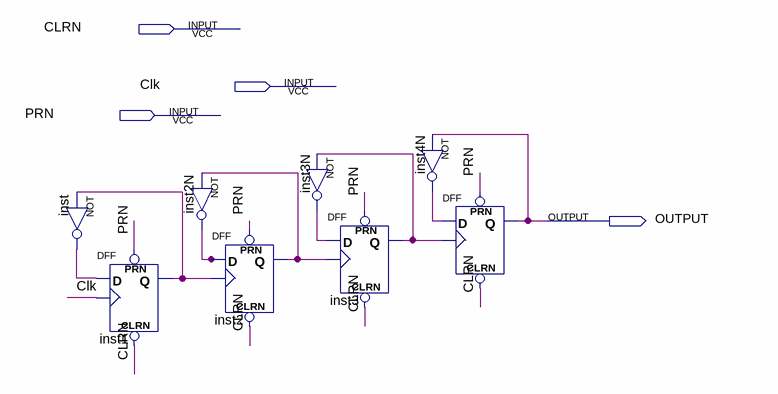
[diagram p0: schematic sheet]
// Quartus schematic FF4.bdf as structural Verilog: 8 symbols, 4 pins
module FF4 (
  input  CLRN,
  input  Clk,
  input  PRN,
  output OUTPUT
);

  wire inst1_q, inst2_q, inst2N_out, inst3_q, inst3N_out, inst4N_out, inst_out;

  not inst (inst_out, inst1_q);
  DFF inst1 (.CLRN(CLRN), .CLK(Clk), .D(inst_out), .PRN(PRN), .Q(inst1_q));
  not inst2N (inst2N_out, inst2_q);
  DFF inst2 (.CLRN(CLRN), .CLK(inst1_q), .D(inst2N_out), .PRN(PRN), .Q(inst2_q));
  not inst3N (inst3N_out, inst3_q);
  DFF inst3 (.CLRN(CLRN), .CLK(inst2_q), .D(inst3N_out), .PRN(PRN), .Q(inst3_q));
  not inst4N (inst4N_out, OUTPUT);
  DFF inst_dup2 (.CLRN(CLRN), .CLK(inst3_q), .D(inst4N_out), .PRN(PRN), .Q(OUTPUT));
endmodule
